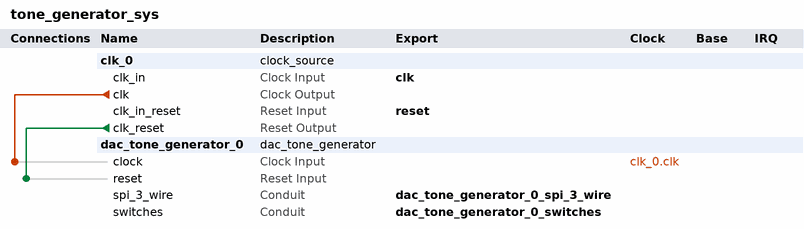
[diagram p0: system contents]
# Platform Designer (Qsys) system tone_generator_sys, MAX 10 10M50DAF484C6GES
# Parameters at their usual value, and those the tool derives, are not listed.
package require -exact qsys 20.1
create_system tone_generator_sys
set_project_property DEVICE_FAMILY {MAX 10}
set_project_property DEVICE 10M50DAF484C6GES

add_instance clk_0 clock_source 20.1
set_instance_parameter_value clk_0 clockFrequency 50000000

add_instance dac_tone_generator_0 dac_tone_generator 1.0

# connections
add_connection clk_0.clk dac_tone_generator_0.clock clock
add_connection clk_0.clk_reset dac_tone_generator_0.reset reset

# exported interfaces
add_interface clk clock sink
set_interface_property clk EXPORT_OF clk_0.clk_in
add_interface dac_tone_generator_0_spi_3_wire conduit end
set_interface_property dac_tone_generator_0_spi_3_wire EXPORT_OF dac_tone_generator_0.spi_3_wire
add_interface dac_tone_generator_0_switches conduit end
set_interface_property dac_tone_generator_0_switches EXPORT_OF dac_tone_generator_0.switches
add_interface reset reset sink
set_interface_property reset EXPORT_OF clk_0.clk_in_reset

set_interconnect_requirement {$system} qsys_mm.clockCrossingAdapter HANDSHAKE
set_interconnect_requirement {$system} qsys_mm.enableEccProtection FALSE
set_interconnect_requirement {$system} qsys_mm.insertDefaultSlave FALSE
set_interconnect_requirement {$system} qsys_mm.maxAdditionalLatency 1

save_system tone_generator_sys.qsys
